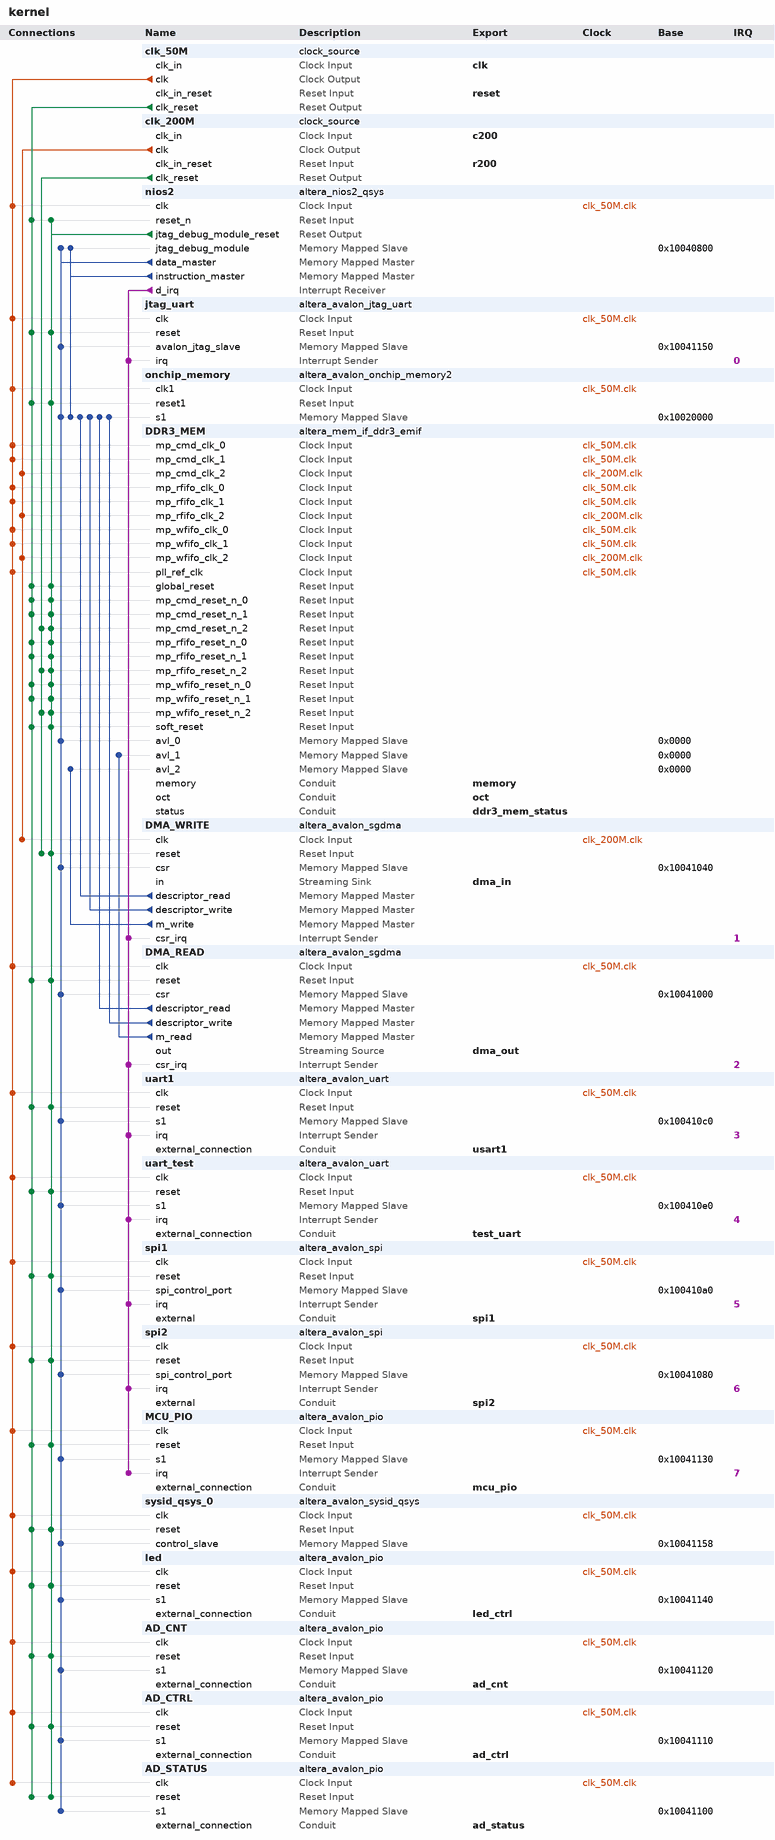
[diagram p0: system contents]
# Platform Designer (Qsys) system kernel, Cyclone V 5CEFA9F23I7
# Parameters at their usual value, and those the tool derives, are not listed.
package require -exact qsys 12.1
create_system kernel
set_project_property DEVICE_FAMILY {Cyclone V}
set_project_property DEVICE 5CEFA9F23I7

add_instance clk_50M clock_source 12.1
set_instance_parameter_value clk_50M clockFrequency 50000000

add_instance clk_200M clock_source 12.1
set_instance_parameter_value clk_200M clockFrequency 200000000

add_instance nios2 altera_nios2_qsys 12.1
set_instance_parameter_value nios2 resetSlave onchip_memory.s1
set_instance_parameter_value nios2 exceptionSlave onchip_memory.s1
set_instance_parameter_value nios2 breakSlave nios2.jtag_debug_module
set_instance_parameter_value nios2 impl Fast
set_instance_parameter_value nios2 icache_size 4096

add_instance jtag_uart altera_avalon_jtag_uart 12.1
set_instance_parameter_value jtag_uart simInteractiveOptions INTERACTIVE_ASCII_OUTPUT

add_instance onchip_memory altera_avalon_onchip_memory2 12.1
set_instance_parameter_value onchip_memory dataWidth 32
set_instance_parameter_value onchip_memory dualPort false
set_instance_parameter_value onchip_memory initMemContent true
set_instance_parameter_value onchip_memory initializationFileName onchip_memory
set_instance_parameter_value onchip_memory memorySize 81920

add_instance DDR3_MEM altera_mem_if_ddr3_emif 12.1
set_instance_parameter_value DDR3_MEM MEM_VENDOR Micron
set_instance_parameter_value DDR3_MEM MEM_FORMAT DISCRETE
set_instance_parameter_value DDR3_MEM MEM_CLK_FREQ_MAX 666.667
set_instance_parameter_value DDR3_MEM MEM_ROW_ADDR_WIDTH 14
set_instance_parameter_value DDR3_MEM MEM_COL_ADDR_WIDTH 10
set_instance_parameter_value DDR3_MEM MEM_DQ_WIDTH 16
set_instance_parameter_value DDR3_MEM MEM_BANKADDR_WIDTH 3
set_instance_parameter_value DDR3_MEM MEM_ASR Automatic
set_instance_parameter_value DDR3_MEM MEM_RTT_NOM RZQ/4
set_instance_parameter_value DDR3_MEM MEM_WTCL 8
set_instance_parameter_value DDR3_MEM MEM_TCL 11
set_instance_parameter_value DDR3_MEM TIMING_TIS 190
set_instance_parameter_value DDR3_MEM TIMING_TIH 140
set_instance_parameter_value DDR3_MEM TIMING_TDS 30
set_instance_parameter_value DDR3_MEM TIMING_TDH 65
set_instance_parameter_value DDR3_MEM TIMING_TDQSQ 125
set_instance_parameter_value DDR3_MEM TIMING_TDQSCK 255
set_instance_parameter_value DDR3_MEM TIMING_TDQSS 0.25
set_instance_parameter_value DDR3_MEM TIMING_TQSH 0.4
set_instance_parameter_value DDR3_MEM TIMING_TDSH 0.2
set_instance_parameter_value DDR3_MEM TIMING_TDSS 0.2
set_instance_parameter_value DDR3_MEM MEM_TRAS_NS 36.0
set_instance_parameter_value DDR3_MEM MEM_TRCD_NS 13.5
set_instance_parameter_value DDR3_MEM MEM_TRP_NS 13.5
set_instance_parameter_value DDR3_MEM MEM_TRFC_NS 160.0
set_instance_parameter_value DDR3_MEM MEM_TWTR 5
set_instance_parameter_value DDR3_MEM MEM_TFAW_NS 45.0
set_instance_parameter_value DDR3_MEM MEM_TRRD_NS 7.5
set_instance_parameter_value DDR3_MEM MEM_TRTP_NS 7.5
set_instance_parameter_value DDR3_MEM RATE Full
set_instance_parameter_value DDR3_MEM MEM_CLK_FREQ 400.0
set_instance_parameter_value DDR3_MEM SPEED_GRADE 7
set_instance_parameter_value DDR3_MEM HARD_EMIF true
set_instance_parameter_value DDR3_MEM POWER_OF_TWO_BUS true
set_instance_parameter_value DDR3_MEM AVL_MAX_SIZE 8
set_instance_parameter_value DDR3_MEM NUM_OF_PORTS 3
set_instance_parameter_value DDR3_MEM PRIORITY_PORT 1,1,1,1,1,1
set_instance_parameter_value DDR3_MEM CPORT_TYPE_PORT Bidirectional,Bidirectional,Bidirectional,Bidirectional,Bidirectional,Bidirectional
set_instance_parameter_value DDR3_MEM REF_CLK_FREQ 50.0
set_instance_parameter_value DDR3_MEM DEFAULT_FAST_SIM_MODEL true
set_instance_parameter_value DDR3_MEM EXPORT_AFI_HALF_CLK false
set_instance_parameter_value DDR3_MEM PLL_LOCATION Top_Bottom
set_instance_parameter_value DDR3_MEM CALIBRATION_MODE Skip
set_instance_parameter_value DDR3_MEM USER_DEBUG_LEVEL 1
set_instance_parameter_value DDR3_MEM TIMING_BOARD_MAX_CK_DELAY 0.6
set_instance_parameter_value DDR3_MEM TIMING_BOARD_MAX_DQS_DELAY 0.6
set_instance_parameter_value DDR3_MEM TIMING_BOARD_SKEW_CKDQS_DIMM_MIN -0.01
set_instance_parameter_value DDR3_MEM TIMING_BOARD_SKEW_CKDQS_DIMM_MAX 0.01
set_instance_parameter_value DDR3_MEM TIMING_BOARD_SKEW_WITHIN_DQS 0.02
set_instance_parameter_value DDR3_MEM TIMING_BOARD_SKEW_BETWEEN_DQS 0.02
set_instance_parameter_value DDR3_MEM TIMING_BOARD_DQ_TO_DQS_SKEW 0.0
set_instance_parameter_value DDR3_MEM TIMING_BOARD_AC_SKEW 0.02
set_instance_parameter_value DDR3_MEM TIMING_BOARD_AC_TO_CK_SKEW 0.0

add_instance DMA_WRITE altera_avalon_sgdma 12.1
set_instance_parameter_value DMA_WRITE enableBurstTransfers false
set_instance_parameter_value DMA_WRITE enableUnalignedTransfers false
set_instance_parameter_value DMA_WRITE readBlockDataWidth 32
set_instance_parameter_value DMA_WRITE sinkErrorWidth 0
set_instance_parameter_value DMA_WRITE sourceErrorWidth 0
set_instance_parameter_value DMA_WRITE transferMode STREAM_TO_MEMORY
set_instance_parameter_value DMA_WRITE writeBurstcountWidth 4

add_instance DMA_READ altera_avalon_sgdma 12.1
set_instance_parameter_value DMA_READ enableBurstTransfers false
set_instance_parameter_value DMA_READ enableUnalignedTransfers false
set_instance_parameter_value DMA_READ readBlockDataWidth 32
set_instance_parameter_value DMA_READ sinkErrorWidth 0
set_instance_parameter_value DMA_READ sourceErrorWidth 0
set_instance_parameter_value DMA_READ transferMode MEMORY_TO_STREAM
set_instance_parameter_value DMA_READ writeBurstcountWidth 4

add_instance uart1 altera_avalon_uart 12.1
set_instance_parameter_value uart1 baud 9600
set_instance_parameter_value uart1 dataBits 8
set_instance_parameter_value uart1 fixedBaud true
set_instance_parameter_value uart1 parity NONE
set_instance_parameter_value uart1 stopBits 1

add_instance uart_test altera_avalon_uart 12.1
set_instance_parameter_value uart_test baud 9600
set_instance_parameter_value uart_test dataBits 8
set_instance_parameter_value uart_test fixedBaud true
set_instance_parameter_value uart_test parity NONE
set_instance_parameter_value uart_test stopBits 1

add_instance spi1 altera_avalon_spi 12.1
set_instance_parameter_value spi1 clockPolarity 0
set_instance_parameter_value spi1 dataWidth 8
set_instance_parameter_value spi1 masterSPI false
set_instance_parameter_value spi1 numberOfSlaves 1
set_instance_parameter_value spi1 targetClockRate 128000

add_instance spi2 altera_avalon_spi 12.1
set_instance_parameter_value spi2 clockPolarity 0
set_instance_parameter_value spi2 dataWidth 8
set_instance_parameter_value spi2 masterSPI false
set_instance_parameter_value spi2 numberOfSlaves 1
set_instance_parameter_value spi2 targetClockRate 128000

add_instance MCU_PIO altera_avalon_pio 12.1
set_instance_parameter_value MCU_PIO direction Input
set_instance_parameter_value MCU_PIO generateIRQ true
set_instance_parameter_value MCU_PIO width 7

add_instance sysid_qsys_0 altera_avalon_sysid_qsys 12.1
set_instance_parameter_value sysid_qsys_0 id 0

add_instance led altera_avalon_pio 12.1
set_instance_parameter_value led direction Output
set_instance_parameter_value led width 4

add_instance AD_CNT altera_avalon_pio 12.1
set_instance_parameter_value AD_CNT direction Output
set_instance_parameter_value AD_CNT width 16

add_instance AD_CTRL altera_avalon_pio 12.1
set_instance_parameter_value AD_CTRL direction Output
set_instance_parameter_value AD_CTRL width 8

add_instance AD_STATUS altera_avalon_pio 12.1
set_instance_parameter_value AD_STATUS direction Input
set_instance_parameter_value AD_STATUS width 4

# connections
add_connection clk_50M.clk AD_CNT.clk clock
add_connection clk_50M.clk AD_CTRL.clk clock
add_connection clk_50M.clk AD_STATUS.clk clock
add_connection clk_50M.clk DDR3_MEM.mp_cmd_clk_0 clock
add_connection clk_50M.clk DDR3_MEM.mp_cmd_clk_1 clock
add_connection clk_50M.clk DDR3_MEM.mp_rfifo_clk_0 clock
add_connection clk_50M.clk DDR3_MEM.mp_rfifo_clk_1 clock
add_connection clk_50M.clk DDR3_MEM.mp_wfifo_clk_0 clock
add_connection clk_50M.clk DDR3_MEM.mp_wfifo_clk_1 clock
add_connection clk_50M.clk DDR3_MEM.pll_ref_clk clock
add_connection clk_50M.clk DMA_READ.clk clock
add_connection clk_50M.clk jtag_uart.clk clock
add_connection clk_50M.clk led.clk clock
add_connection clk_50M.clk MCU_PIO.clk clock
add_connection clk_50M.clk nios2.clk clock
add_connection clk_50M.clk onchip_memory.clk1 clock
add_connection clk_50M.clk spi1.clk clock
add_connection clk_50M.clk spi2.clk clock
add_connection clk_50M.clk sysid_qsys_0.clk clock
add_connection clk_50M.clk uart1.clk clock
add_connection clk_50M.clk uart_test.clk clock
add_connection clk_200M.clk DDR3_MEM.mp_cmd_clk_2 clock
add_connection clk_200M.clk DDR3_MEM.mp_rfifo_clk_2 clock
add_connection clk_200M.clk DDR3_MEM.mp_wfifo_clk_2 clock
add_connection clk_200M.clk DMA_WRITE.clk clock
add_connection clk_50M.clk_reset AD_CNT.reset reset
add_connection clk_50M.clk_reset AD_CTRL.reset reset
add_connection clk_50M.clk_reset AD_STATUS.reset reset
add_connection clk_50M.clk_reset DDR3_MEM.global_reset reset
add_connection clk_50M.clk_reset DDR3_MEM.mp_cmd_reset_n_0 reset
add_connection clk_50M.clk_reset DDR3_MEM.mp_cmd_reset_n_1 reset
add_connection clk_50M.clk_reset DDR3_MEM.mp_rfifo_reset_n_0 reset
add_connection clk_50M.clk_reset DDR3_MEM.mp_rfifo_reset_n_1 reset
add_connection clk_50M.clk_reset DDR3_MEM.mp_wfifo_reset_n_0 reset
add_connection clk_50M.clk_reset DDR3_MEM.mp_wfifo_reset_n_1 reset
add_connection clk_50M.clk_reset DDR3_MEM.soft_reset reset
add_connection clk_50M.clk_reset DMA_READ.reset reset
add_connection clk_50M.clk_reset jtag_uart.reset reset
add_connection clk_50M.clk_reset led.reset reset
add_connection clk_50M.clk_reset MCU_PIO.reset reset
add_connection clk_50M.clk_reset nios2.reset_n reset
add_connection clk_50M.clk_reset onchip_memory.reset1 reset
add_connection clk_50M.clk_reset spi1.reset reset
add_connection clk_50M.clk_reset spi2.reset reset
add_connection clk_50M.clk_reset sysid_qsys_0.reset reset
add_connection clk_50M.clk_reset uart1.reset reset
add_connection clk_50M.clk_reset uart_test.reset reset
add_connection clk_200M.clk_reset DDR3_MEM.mp_cmd_reset_n_2 reset
add_connection clk_200M.clk_reset DDR3_MEM.mp_rfifo_reset_n_2 reset
add_connection clk_200M.clk_reset DDR3_MEM.mp_wfifo_reset_n_2 reset
add_connection clk_200M.clk_reset DMA_WRITE.reset reset
add_connection nios2.jtag_debug_module_reset AD_CNT.reset reset
add_connection nios2.jtag_debug_module_reset AD_CTRL.reset reset
add_connection nios2.jtag_debug_module_reset AD_STATUS.reset reset
add_connection nios2.jtag_debug_module_reset DDR3_MEM.global_reset reset
add_connection nios2.jtag_debug_module_reset DDR3_MEM.mp_cmd_reset_n_0 reset
add_connection nios2.jtag_debug_module_reset DDR3_MEM.mp_cmd_reset_n_1 reset
add_connection nios2.jtag_debug_module_reset DDR3_MEM.mp_cmd_reset_n_2 reset
add_connection nios2.jtag_debug_module_reset DDR3_MEM.mp_rfifo_reset_n_0 reset
add_connection nios2.jtag_debug_module_reset DDR3_MEM.mp_rfifo_reset_n_1 reset
add_connection nios2.jtag_debug_module_reset DDR3_MEM.mp_rfifo_reset_n_2 reset
add_connection nios2.jtag_debug_module_reset DDR3_MEM.mp_wfifo_reset_n_0 reset
add_connection nios2.jtag_debug_module_reset DDR3_MEM.mp_wfifo_reset_n_1 reset
add_connection nios2.jtag_debug_module_reset DDR3_MEM.mp_wfifo_reset_n_2 reset
add_connection nios2.jtag_debug_module_reset DDR3_MEM.soft_reset reset
add_connection nios2.jtag_debug_module_reset DMA_READ.reset reset
add_connection nios2.jtag_debug_module_reset DMA_WRITE.reset reset
add_connection nios2.jtag_debug_module_reset jtag_uart.reset reset
add_connection nios2.jtag_debug_module_reset led.reset reset
add_connection nios2.jtag_debug_module_reset MCU_PIO.reset reset
add_connection nios2.jtag_debug_module_reset nios2.reset_n reset
add_connection nios2.jtag_debug_module_reset onchip_memory.reset1 reset
add_connection nios2.jtag_debug_module_reset spi1.reset reset
add_connection nios2.jtag_debug_module_reset spi2.reset reset
add_connection nios2.jtag_debug_module_reset sysid_qsys_0.reset reset
add_connection nios2.jtag_debug_module_reset uart1.reset reset
add_connection nios2.jtag_debug_module_reset uart_test.reset reset
add_connection DMA_READ.descriptor_read onchip_memory.s1 avalon
set_connection_parameter_value DMA_READ.descriptor_read/onchip_memory.s1 baseAddress 0x10020000
add_connection DMA_READ.descriptor_write onchip_memory.s1 avalon
set_connection_parameter_value DMA_READ.descriptor_write/onchip_memory.s1 baseAddress 0x10020000
add_connection DMA_READ.m_read DDR3_MEM.avl_1 avalon
set_connection_parameter_value DMA_READ.m_read/DDR3_MEM.avl_1 baseAddress 0x0000
add_connection DMA_WRITE.descriptor_read onchip_memory.s1 avalon
set_connection_parameter_value DMA_WRITE.descriptor_read/onchip_memory.s1 baseAddress 0x10020000
add_connection DMA_WRITE.descriptor_write onchip_memory.s1 avalon
set_connection_parameter_value DMA_WRITE.descriptor_write/onchip_memory.s1 baseAddress 0x10020000
add_connection DMA_WRITE.m_write DDR3_MEM.avl_2 avalon
set_connection_parameter_value DMA_WRITE.m_write/DDR3_MEM.avl_2 baseAddress 0x0000
add_connection nios2.data_master AD_CNT.s1 avalon
set_connection_parameter_value nios2.data_master/AD_CNT.s1 baseAddress 0x10041120
add_connection nios2.data_master AD_CTRL.s1 avalon
set_connection_parameter_value nios2.data_master/AD_CTRL.s1 baseAddress 0x10041110
add_connection nios2.data_master AD_STATUS.s1 avalon
set_connection_parameter_value nios2.data_master/AD_STATUS.s1 baseAddress 0x10041100
add_connection nios2.data_master DDR3_MEM.avl_0 avalon
set_connection_parameter_value nios2.data_master/DDR3_MEM.avl_0 baseAddress 0x0000
add_connection nios2.data_master DMA_READ.csr avalon
set_connection_parameter_value nios2.data_master/DMA_READ.csr baseAddress 0x10041000
add_connection nios2.data_master DMA_WRITE.csr avalon
set_connection_parameter_value nios2.data_master/DMA_WRITE.csr baseAddress 0x10041040
add_connection nios2.data_master jtag_uart.avalon_jtag_slave avalon
set_connection_parameter_value nios2.data_master/jtag_uart.avalon_jtag_slave baseAddress 0x10041150
add_connection nios2.data_master led.s1 avalon
set_connection_parameter_value nios2.data_master/led.s1 baseAddress 0x10041140
add_connection nios2.data_master MCU_PIO.s1 avalon
set_connection_parameter_value nios2.data_master/MCU_PIO.s1 baseAddress 0x10041130
add_connection nios2.data_master nios2.jtag_debug_module avalon
set_connection_parameter_value nios2.data_master/nios2.jtag_debug_module baseAddress 0x10040800
add_connection nios2.data_master onchip_memory.s1 avalon
set_connection_parameter_value nios2.data_master/onchip_memory.s1 baseAddress 0x10020000
add_connection nios2.data_master spi1.spi_control_port avalon
set_connection_parameter_value nios2.data_master/spi1.spi_control_port baseAddress 0x100410a0
add_connection nios2.data_master spi2.spi_control_port avalon
set_connection_parameter_value nios2.data_master/spi2.spi_control_port baseAddress 0x10041080
add_connection nios2.data_master sysid_qsys_0.control_slave avalon
set_connection_parameter_value nios2.data_master/sysid_qsys_0.control_slave baseAddress 0x10041158
add_connection nios2.data_master uart1.s1 avalon
set_connection_parameter_value nios2.data_master/uart1.s1 baseAddress 0x100410c0
add_connection nios2.data_master uart_test.s1 avalon
set_connection_parameter_value nios2.data_master/uart_test.s1 baseAddress 0x100410e0
add_connection nios2.instruction_master nios2.jtag_debug_module avalon
set_connection_parameter_value nios2.instruction_master/nios2.jtag_debug_module baseAddress 0x10040800
add_connection nios2.instruction_master onchip_memory.s1 avalon
set_connection_parameter_value nios2.instruction_master/onchip_memory.s1 baseAddress 0x10020000
add_connection nios2.d_irq DMA_READ.csr_irq interrupt
set_connection_parameter_value nios2.d_irq/DMA_READ.csr_irq irqNumber 2
add_connection nios2.d_irq DMA_WRITE.csr_irq interrupt
set_connection_parameter_value nios2.d_irq/DMA_WRITE.csr_irq irqNumber 1
add_connection nios2.d_irq jtag_uart.irq interrupt
set_connection_parameter_value nios2.d_irq/jtag_uart.irq irqNumber 0
add_connection nios2.d_irq MCU_PIO.irq interrupt
set_connection_parameter_value nios2.d_irq/MCU_PIO.irq irqNumber 7
add_connection nios2.d_irq spi1.irq interrupt
set_connection_parameter_value nios2.d_irq/spi1.irq irqNumber 5
add_connection nios2.d_irq spi2.irq interrupt
set_connection_parameter_value nios2.d_irq/spi2.irq irqNumber 6
add_connection nios2.d_irq uart1.irq interrupt
set_connection_parameter_value nios2.d_irq/uart1.irq irqNumber 3
add_connection nios2.d_irq uart_test.irq interrupt
set_connection_parameter_value nios2.d_irq/uart_test.irq irqNumber 4

# exported interfaces
add_interface clk clock sink
set_interface_property clk EXPORT_OF clk_50M.clk_in
add_interface led_ctrl conduit end
set_interface_property led_ctrl EXPORT_OF led.external_connection
add_interface reset reset sink
set_interface_property reset EXPORT_OF clk_50M.clk_in_reset
add_interface test_uart conduit end
set_interface_property test_uart EXPORT_OF uart_test.external_connection
add_interface memory conduit end
set_interface_property memory EXPORT_OF DDR3_MEM.memory
add_interface ddr3_mem_status conduit end
set_interface_property ddr3_mem_status EXPORT_OF DDR3_MEM.status
add_interface oct conduit end
set_interface_property oct EXPORT_OF DDR3_MEM.oct
add_interface c200 clock sink
set_interface_property c200 EXPORT_OF clk_200M.clk_in
add_interface r200 reset sink
set_interface_property r200 EXPORT_OF clk_200M.clk_in_reset
add_interface dma_in avalon_streaming sink
set_interface_property dma_in EXPORT_OF DMA_WRITE.in
add_interface mcu_pio conduit end
set_interface_property mcu_pio EXPORT_OF MCU_PIO.external_connection
add_interface usart1 conduit end
set_interface_property usart1 EXPORT_OF uart1.external_connection
add_interface spi1 conduit end
set_interface_property spi1 EXPORT_OF spi1.external
add_interface spi2 conduit end
set_interface_property spi2 EXPORT_OF spi2.external
add_interface ad_cnt conduit end
set_interface_property ad_cnt EXPORT_OF AD_CNT.external_connection
add_interface ad_ctrl conduit end
set_interface_property ad_ctrl EXPORT_OF AD_CTRL.external_connection
add_interface ad_status conduit end
set_interface_property ad_status EXPORT_OF AD_STATUS.external_connection
add_interface dma_out avalon_streaming source
set_interface_property dma_out EXPORT_OF DMA_READ.out

save_system kernel.qsys
